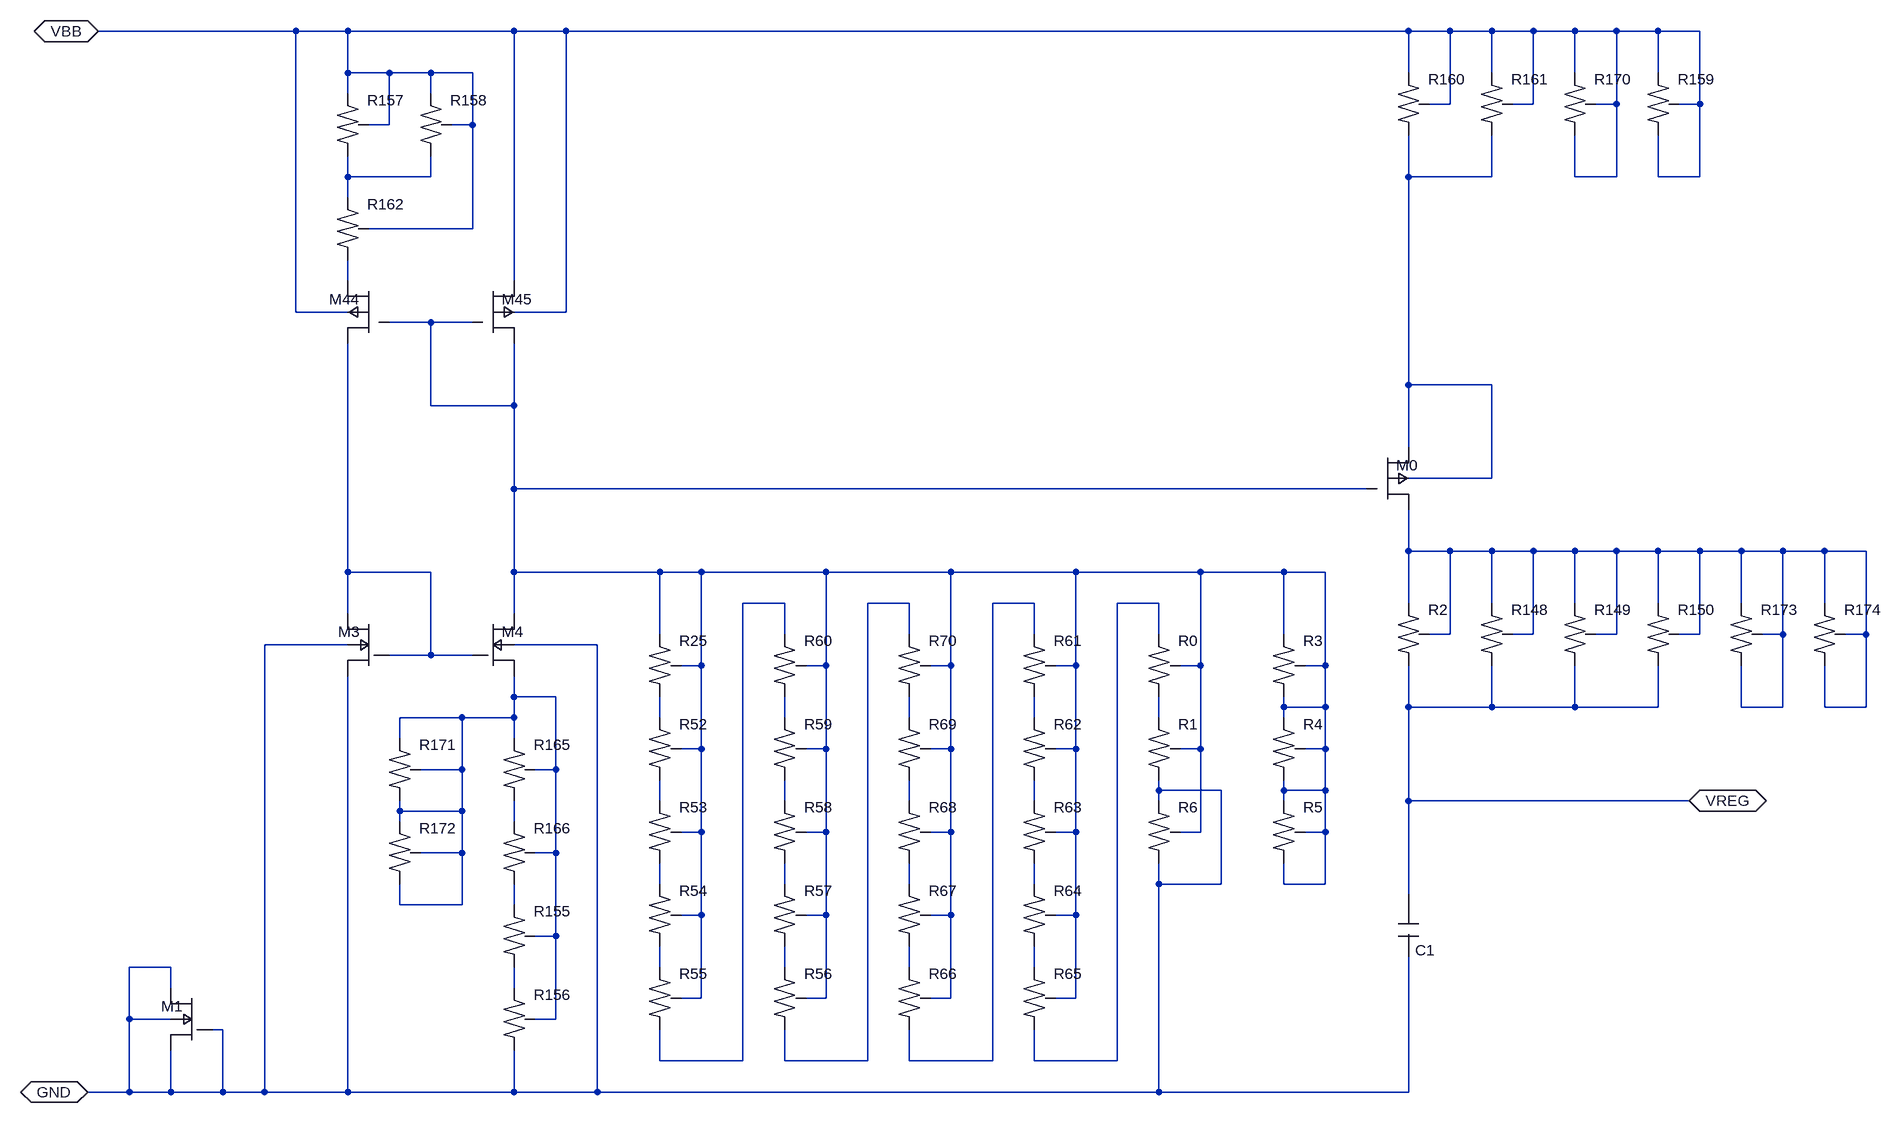
[diagram p0: schematic &462STUP_00_00.asc]
&462STUP_00_00.asc, the LTspice schematic file:
Version 4
SHEET 1 7088 2000
WIRE 32 -384 336 -384
WIRE 544 -320 608 -320
WIRE 752 -384 2048 -384
WIRE 416 -384 672 -384
WIRE 608 -240 608 -320
WIRE 416 -288 416 -320
WIRE 448 -240 480 -240
WIRE 608 -80 608 -240
WIRE 576 -240 608 -240
WIRE 672 48 752 48
WIRE 416 -320 480 -320
WIRE 752 48 752 -384
WIRE 448 -80 608 -80
WIRE 416 -320 416 -384
WIRE 480 -320 544 -320
WIRE 336 48 336 -384
WIRE 336 48 416 48
WIRE 672 -384 752 -384
WIRE 672 0 672 -384
WIRE 544 -288 544 -320
WIRE 2304 -160 2368 -160
WIRE 336 -384 416 -384
WIRE 2304 -320 2304 -384
WIRE 2368 -384 2432 -384
WIRE 2048 -320 2048 -384
WIRE 2048 -384 2112 -384
WIRE 2176 -320 2176 -384
WIRE 2080 -272 2112 -272
WIRE 2112 -384 2176 -384
WIRE 2112 -272 2112 -384
WIRE 2176 -384 2240 -384
WIRE 2240 -272 2240 -384
WIRE 2208 -272 2240 -272
WIRE 2304 -160 2304 -224
WIRE 2432 -384 2496 -384
WIRE 2432 -320 2432 -384
WIRE 2496 -160 2496 -272
WIRE 2432 -160 2496 -160
WIRE 2432 -160 2432 -224
WIRE 2368 -272 2368 -384
WIRE 2240 -384 2304 -384
WIRE 2336 -272 2368 -272
WIRE 2304 -384 2368 -384
WIRE 2496 -272 2496 -384
WIRE 2464 -272 2496 -272
WIRE 480 -240 480 -320
WIRE 2368 -160 2368 -272
WIRE 1472 928 1472 896
WIRE 1088 1056 1088 1024
WIRE 1280 928 1280 896
WIRE 416 0 416 -32
WIRE 1472 800 1472 768
WIRE 896 928 896 896
WIRE 1280 1200 1408 1200
WIRE 1280 1200 1280 1152
WIRE 1472 544 1472 496
WIRE 1408 496 1472 496
WIRE 1408 1200 1408 496
WIRE 672 832 672 800
WIRE 1280 672 1280 640
WIRE 1664 928 1760 928
WIRE 1664 928 1664 896
WIRE 1664 784 1760 784
WIRE 1760 928 1760 784
WIRE 1664 784 1664 768
WIRE 80 1056 144 1056
WIRE 80 1136 144 1136
WIRE 80 1248 80 1136
WIRE 1664 1248 1664 928
WIRE 1664 800 1664 784
WIRE 144 1248 224 1248
WIRE 144 1088 144 1056
WIRE 224 1248 224 1152
WIRE 16 1248 80 1248
WIRE 144 1248 144 1184
WIRE 224 1248 288 1248
WIRE 80 1136 80 1056
WIRE 1664 1248 2048 1248
WIRE 288 1248 416 1248
WIRE 672 1248 672 1184
WIRE 800 1248 800 560
WIRE 80 1248 144 1248
WIRE 800 1248 1664 1248
WIRE 288 560 416 560
WIRE 672 560 800 560
WIRE 208 1152 224 1152
WIRE 672 1248 800 1248
WIRE 416 1248 672 1248
WIRE 288 1248 288 560
WIRE 2048 1248 2048 1040
WIRE 416 1248 416 608
WIRE 2176 656 2176 592
WIRE 2048 656 2048 592
WIRE 2304 656 2304 592
WIRE 2048 656 2176 656
WIRE 2176 656 2304 656
WIRE 2304 656 2432 656
WIRE 2432 656 2432 592
WIRE 2048 944 2048 800
WIRE 2048 800 2480 800
WIRE 2048 800 2048 656
WIRE 672 960 672 928
WIRE 1280 1056 1280 1024
WIRE 672 1088 672 1056
WIRE 1088 672 1088 640
WIRE 1664 672 1664 640
WIRE 1696 848 1728 848
WIRE 1856 928 1920 928
WIRE 1856 928 1856 896
WIRE 1856 784 1920 784
WIRE 1920 784 1920 720
WIRE 1856 784 1856 768
WIRE 1856 656 1920 656
WIRE 1920 656 1920 592
WIRE 1856 656 1856 640
WIRE 1888 592 1920 592
WIRE 1920 592 1920 448
WIRE 1888 720 1920 720
WIRE 1920 720 1920 656
WIRE 1888 848 1920 848
WIRE 1920 848 1920 784
WIRE 1920 928 1920 848
WIRE 1856 448 1920 448
WIRE 1728 448 1856 448
WIRE 1856 800 1856 784
WIRE 1856 672 1856 656
WIRE 1856 544 1856 448
WIRE 1312 592 1344 592
WIRE 1152 448 1344 448
WIRE 672 320 1984 320
WIRE 1312 720 1344 720
WIRE 1312 848 1344 848
WIRE 1312 976 1344 976
WIRE 1312 1104 1344 1104
WIRE 1152 1104 1152 976
WIRE 960 592 960 448
WIRE 928 592 960 592
WIRE 960 848 960 720
WIRE 928 720 960 720
WIRE 928 848 960 848
WIRE 928 976 960 976
WIRE 960 976 960 848
WIRE 928 1104 960 1104
WIRE 960 1104 960 976
WIRE 896 448 960 448
WIRE 1120 1104 1152 1104
WIRE 1120 720 1152 720
WIRE 1152 976 1152 848
WIRE 1152 720 1152 592
WIRE 1120 976 1152 976
WIRE 960 720 960 592
WIRE 1152 848 1152 720
WIRE 1120 592 1152 592
WIRE 1120 848 1152 848
WIRE 1152 592 1152 448
WIRE 896 544 896 448
WIRE 672 512 672 448
WIRE 480 64 544 64
WIRE 544 64 608 64
WIRE 672 448 896 448
WIRE 672 320 672 192
WIRE 672 448 672 320
WIRE 544 192 672 192
WIRE 1504 720 1536 720
WIRE 1728 848 1728 720
WIRE 1344 448 1536 448
WIRE 1344 976 1344 848
WIRE 1504 848 1536 848
WIRE 1536 976 1536 848
WIRE 1536 848 1536 720
WIRE 1536 1104 1536 976
WIRE 1536 720 1536 592
WIRE 1536 592 1536 448
WIRE 1504 1104 1536 1104
WIRE 1344 1104 1344 976
WIRE 1344 720 1344 592
WIRE 1504 592 1536 592
WIRE 1504 976 1536 976
WIRE 1344 848 1344 720
WIRE 1344 592 1344 448
WIRE 544 192 544 64
WIRE 960 448 1152 448
WIRE 1696 720 1728 720
WIRE 1536 448 1728 448
WIRE 1728 720 1728 592
WIRE 672 192 672 96
WIRE 1696 592 1728 592
WIRE 1728 592 1728 448
WIRE 896 672 896 640
WIRE 416 -128 416 -160
WIRE 544 -160 544 -192
WIRE 416 -160 416 -192
WIRE 416 -160 544 -160
WIRE 1280 800 1280 768
WIRE 736 1008 736 880
WIRE 704 1136 736 1136
WIRE 496 816 592 816
WIRE 704 880 736 880
WIRE 736 880 736 752
WIRE 592 816 592 752
WIRE 704 752 736 752
WIRE 672 640 736 640
WIRE 672 640 672 608
WIRE 736 752 736 640
WIRE 528 880 592 880
WIRE 496 672 592 672
WIRE 592 752 592 672
WIRE 496 832 496 816
WIRE 496 960 592 960
WIRE 496 816 496 800
WIRE 592 880 592 816
WIRE 528 752 592 752
WIRE 592 960 592 880
WIRE 672 672 672 640
WIRE 672 704 672 672
WIRE 704 1008 736 1008
WIRE 496 704 496 672
WIRE 736 1136 736 1008
WIRE 592 672 672 672
WIRE 496 960 496 928
WIRE 896 800 896 768
WIRE 1088 1200 1216 1200
WIRE 1216 1200 1216 496
WIRE 1216 496 1280 496
WIRE 1280 544 1280 496
WIRE 1088 1200 1088 1152
WIRE 1472 1200 1600 1200
WIRE 1664 544 1664 496
WIRE 1600 496 1664 496
WIRE 1472 1200 1472 1152
WIRE 1600 1200 1600 496
WIRE 2048 160 2176 160
WIRE 2176 304 2176 160
WIRE 2048 304 2176 304
WIRE 2176 -160 2176 -224
WIRE 2048 160 2048 -160
WIRE 2048 256 2048 160
WIRE 2048 -160 2176 -160
WIRE 2048 -160 2048 -224
WIRE 1472 672 1472 640
WIRE 1472 1056 1472 1024
WIRE 1088 800 1088 768
WIRE 1088 928 1088 896
WIRE 2368 416 2432 416
WIRE 2048 496 2048 416
WIRE 2176 496 2176 416
WIRE 2368 544 2368 416
WIRE 2112 544 2112 416
WIRE 2080 544 2112 544
WIRE 2304 416 2368 416
WIRE 2048 416 2112 416
WIRE 2048 416 2048 352
WIRE 2432 416 2496 416
WIRE 2208 544 2240 544
WIRE 2464 544 2496 544
WIRE 2496 544 2496 416
WIRE 2112 416 2176 416
WIRE 2304 496 2304 416
WIRE 2624 416 2688 416
WIRE 2560 656 2624 656
WIRE 2688 416 2752 416
WIRE 2432 496 2432 416
WIRE 2336 544 2368 544
WIRE 2720 544 2752 544
WIRE 2624 544 2624 416
WIRE 2624 656 2624 544
WIRE 2560 656 2560 592
WIRE 2496 416 2560 416
WIRE 2752 656 2752 544
WIRE 2560 496 2560 416
WIRE 2560 416 2624 416
WIRE 2688 656 2688 592
WIRE 2592 544 2624 544
WIRE 2688 496 2688 416
WIRE 2688 656 2752 656
WIRE 2752 544 2752 416
WIRE 2240 416 2304 416
WIRE 2240 544 2240 416
WIRE 2176 416 2240 416
WIRE 416 448 416 96
WIRE 416 512 416 448
WIRE 544 576 544 448
WIRE 416 448 544 448
WIRE 480 576 544 576
WIRE 544 576 608 576
WIRE 896 1056 896 1024
WIRE 896 1200 896 1152
WIRE 1024 496 1088 496
WIRE 1024 1200 1024 496
WIRE 1088 544 1088 496
WIRE 896 1200 1024 1200
FLAG 16 1248 GND
IOPIN 16 1248 inout
FLAG 32 -384 VBB
IOPIN 32 -384 inout
FLAG 2480 800 VREG
IOPIN 2480 800 inout
SYMBOL RH 1280 928 R0
SYMATTR InstName R67
SYMATTR Value 100.0013K
SYMBOL MNO 208 1136 M0
SYMATTR InstName M1
SYMATTR Value2
SYMBOL MNO 480 560 M0
SYMATTR InstName M3
SYMATTR Value2
SYMBOL RH 1664 800 R0
SYMATTR InstName R6
SYMATTR Value 100.0013K
SYMBOL CSIO 2048 1040 M180
SYMATTR InstName C1
SYMATTR Value 2.0p
SYMBOL RR 672 832 R0
SYMATTR InstName R166
SYMATTR Value 9.99196K
SYMBOL RH 1088 672 R0
SYMATTR InstName R59
SYMATTR Value 100.0013K
SYMBOL RH 1280 544 R0
SYMATTR InstName R70
SYMATTR Value 100.0013K
SYMBOL RR 2432 496 R0
SYMATTR InstName R150
SYMATTR Value 4.010008K
SYMBOL RR 2176 496 R0
SYMATTR InstName R148
SYMATTR Value 4.010008K
SYMBOL RH 1280 800 R0
SYMATTR InstName R68
SYMATTR Value 100.0013K
SYMBOL MPO 1984 304 R0
SYMATTR InstName M0
SYMATTR Value2 m=6 w=50u
SYMBOL RR 672 704 R0
SYMATTR InstName R165
SYMATTR Value 9.99196K
SYMBOL RH 896 672 R0
SYMATTR InstName R52
SYMATTR Value 100.0013K
SYMBOL RR 416 -128 R0
SYMATTR InstName R162
SYMATTR Value 9.99196K
SYMBOL RH 1856 672 R0
SYMATTR InstName R4
SYMATTR Value 100.0013K
SYMBOL RR 672 960 R0
SYMATTR InstName R155
SYMATTR Value 9.99196K
SYMBOL RR 2048 -320 R0
SYMATTR InstName R160
SYMATTR Value 9.99196K
SYMBOL MNO 608 560 R0
SYMATTR InstName M4
SYMATTR Value2 m=5 l=6u
SYMBOL RH 1472 928 R0
SYMATTR InstName R64
SYMATTR Value 100.0013K
SYMBOL RH 1088 1056 R0
SYMATTR InstName R56
SYMATTR Value 100.0013K
SYMBOL RH 896 800 R0
SYMATTR InstName R53
SYMATTR Value 100.0013K
SYMBOL RH 1280 672 R0
SYMATTR InstName R69
SYMATTR Value 100.0013K
SYMBOL RH 1088 800 R0
SYMATTR InstName R58
SYMATTR Value 100.0013K
SYMBOL RR 496 832 R0
SYMATTR InstName R172
SYMATTR Value 9.99196K
SYMBOL RH 1088 928 R0
SYMATTR InstName R57
SYMATTR Value 100.0013K
SYMBOL RR 2048 496 R0
SYMATTR InstName R2
SYMATTR Value 4.010008K
SYMBOL RH 896 1056 R0
SYMATTR InstName R55
SYMATTR Value 100.0013K
SYMBOL RH 1088 544 R0
SYMATTR InstName R60
SYMATTR Value 100.0013K
SYMBOL RH 1472 544 R0
SYMATTR InstName R61
SYMATTR Value 100.0013K
SYMBOL RR 2176 -320 R0
SYMATTR InstName R161
SYMATTR Value 9.99196K
SYMBOL RR 2560 496 R0
SYMATTR InstName R173
SYMATTR Value 4.010008K
SYMBOL RR 496 704 R0
SYMATTR InstName R171
SYMATTR Value 9.99196K
SYMBOL RR 2304 496 R0
SYMATTR InstName R149
SYMATTR Value 4.010008K
SYMBOL RH 1664 544 R0
SYMATTR InstName R0
SYMATTR Value 100.0013K
SYMBOL RH 1280 1056 R0
SYMATTR InstName R66
SYMATTR Value 100.0013K
SYMBOL RH 1856 800 R0
SYMATTR InstName R5
SYMATTR Value 100.0013K
SYMBOL MPO 608 48 R0
SYMATTR InstName M45
SYMATTR Value2 l=4.8u m=2 w=16u
SYMBOL RH 1472 672 R0
SYMATTR InstName R62
SYMATTR Value 100.0013K
SYMBOL RH 896 544 R0
SYMATTR InstName R25
SYMATTR Value 100.0013K
SYMBOL RR 2688 496 R0
SYMATTR InstName R174
SYMATTR Value 4.010008K
SYMBOL RR 2304 -320 R0
SYMATTR InstName R170
SYMATTR Value 9.99196K
SYMBOL RH 1472 1056 R0
SYMATTR InstName R65
SYMATTR Value 100.0013K
SYMBOL MPO 480 48 M0
SYMATTR InstName M44
SYMATTR Value2 l=4.8u w=16u m=2
SYMBOL RH 1664 672 R0
SYMATTR InstName R1
SYMATTR Value 100.0013K
SYMBOL RH 896 928 R0
SYMATTR InstName R54
SYMATTR Value 100.0013K
SYMBOL RR 672 1088 R0
SYMATTR InstName R156
SYMATTR Value 9.99196K
SYMBOL RR 544 -288 R0
SYMATTR InstName R158
SYMATTR Value 9.99196K
SYMBOL RR 416 -288 R0
SYMATTR InstName R157
SYMATTR Value 9.99196K
SYMBOL RR 2432 -320 R0
SYMATTR InstName R159
SYMATTR Value 9.99196K
SYMBOL RH 1856 544 R0
SYMATTR InstName R3
SYMATTR Value 100.0013K
SYMBOL RH 1472 800 R0
SYMATTR InstName R63
SYMATTR Value 100.0013K

The netlist it stands for:
* &462STUP_00_00.asc
XR67 N003 N011 N015 100.0013K  ; pins PLUS MINUS SUB
M1 GND GND GND GND MNO
M3 N029 N029 GND GND MNO
XR6 GND GND N015 100.0013K  ; pins PLUS MINUS SUB
C1 GND VREG 2.0p
XR166 N008 N010 N019 9.99196K  ; pins PLUS MINUS SUB
XR59 N013 N026 N015 100.0013K  ; pins PLUS MINUS SUB
XR70 N021 N009 N015 100.0013K  ; pins PLUS MINUS SUB
XR150 N028 VREG N028 4.010008K  ; pins PLUS MINUS SUB
XR148 N028 VREG N028 4.010008K  ; pins PLUS MINUS SUB
XR68 N018 N003 N015 100.0013K  ; pins PLUS MINUS SUB
M0 N023 N015 N028 N023 MPO m=6 w=50u
XR165 N019 N008 N019 9.99196K  ; pins PLUS MINUS SUB
XR52 N016 N020 N015 100.0013K  ; pins PLUS MINUS SUB
XR162 N017 N004 VBB 9.99196K  ; pins PLUS MINUS SUB
XR4 N015 N015 N015 100.0013K  ; pins PLUS MINUS SUB
XR155 N010 N012 N019 9.99196K  ; pins PLUS MINUS SUB
XR160 VBB N023 VBB 9.99196K  ; pins PLUS MINUS SUB
M4 N015 N029 N019 GND MNO m=5 l=6u
XR64 N001 N025 N015 100.0013K  ; pins PLUS MINUS SUB
XR56 N002 N021 N015 100.0013K  ; pins PLUS MINUS SUB
XR53 N020 N006 N015 100.0013K  ; pins PLUS MINUS SUB
XR69 N009 N018 N015 100.0013K  ; pins PLUS MINUS SUB
XR58 N026 N027 N015 100.0013K  ; pins PLUS MINUS SUB
XR172 N019 N019 N019 9.99196K  ; pins PLUS MINUS SUB
XR57 N027 N002 N015 100.0013K  ; pins PLUS MINUS SUB
XR2 N028 VREG N028 4.010008K  ; pins PLUS MINUS SUB
XR55 N030 N031 N015 100.0013K  ; pins PLUS MINUS SUB
XR60 N031 N013 N015 100.0013K  ; pins PLUS MINUS SUB
XR61 N007 N024 N015 100.0013K  ; pins PLUS MINUS SUB
XR161 VBB N023 VBB 9.99196K  ; pins PLUS MINUS SUB
XR173 N028 N028 N028 4.010008K  ; pins PLUS MINUS SUB
XR171 N019 N019 N019 9.99196K  ; pins PLUS MINUS SUB
XR149 N028 VREG N028 4.010008K  ; pins PLUS MINUS SUB
XR0 N022 N014 N015 100.0013K  ; pins PLUS MINUS SUB
XR66 N011 N007 N015 100.0013K  ; pins PLUS MINUS SUB
XR5 N015 N015 N015 100.0013K  ; pins PLUS MINUS SUB
M45 VBB N015 N015 VBB MPO l=4.8u m=2 w=16u
XR62 N024 N005 N015 100.0013K  ; pins PLUS MINUS SUB
XR25 N015 N016 N015 100.0013K  ; pins PLUS MINUS SUB
XR174 N028 N028 N028 4.010008K  ; pins PLUS MINUS SUB
XR170 VBB VBB VBB 9.99196K  ; pins PLUS MINUS SUB
XR65 N025 N022 N015 100.0013K  ; pins PLUS MINUS SUB
M44 N004 N015 N029 VBB MPO l=4.8u w=16u m=2
XR1 N014 GND N015 100.0013K  ; pins PLUS MINUS SUB
XR54 N006 N030 N015 100.0013K  ; pins PLUS MINUS SUB
XR156 N012 GND N019 9.99196K  ; pins PLUS MINUS SUB
XR158 VBB N017 VBB 9.99196K  ; pins PLUS MINUS SUB
XR157 VBB N017 VBB 9.99196K  ; pins PLUS MINUS SUB
XR159 VBB VBB VBB 9.99196K  ; pins PLUS MINUS SUB
XR3 N015 N015 N015 100.0013K  ; pins PLUS MINUS SUB
XR63 N005 N001 N015 100.0013K  ; pins PLUS MINUS SUB
.model NMOS NMOS
.model PMOS PMOS
.lib standard.mos
.backanno
.end